# EAGLE design garden_control (EAGLE 8.3.2)
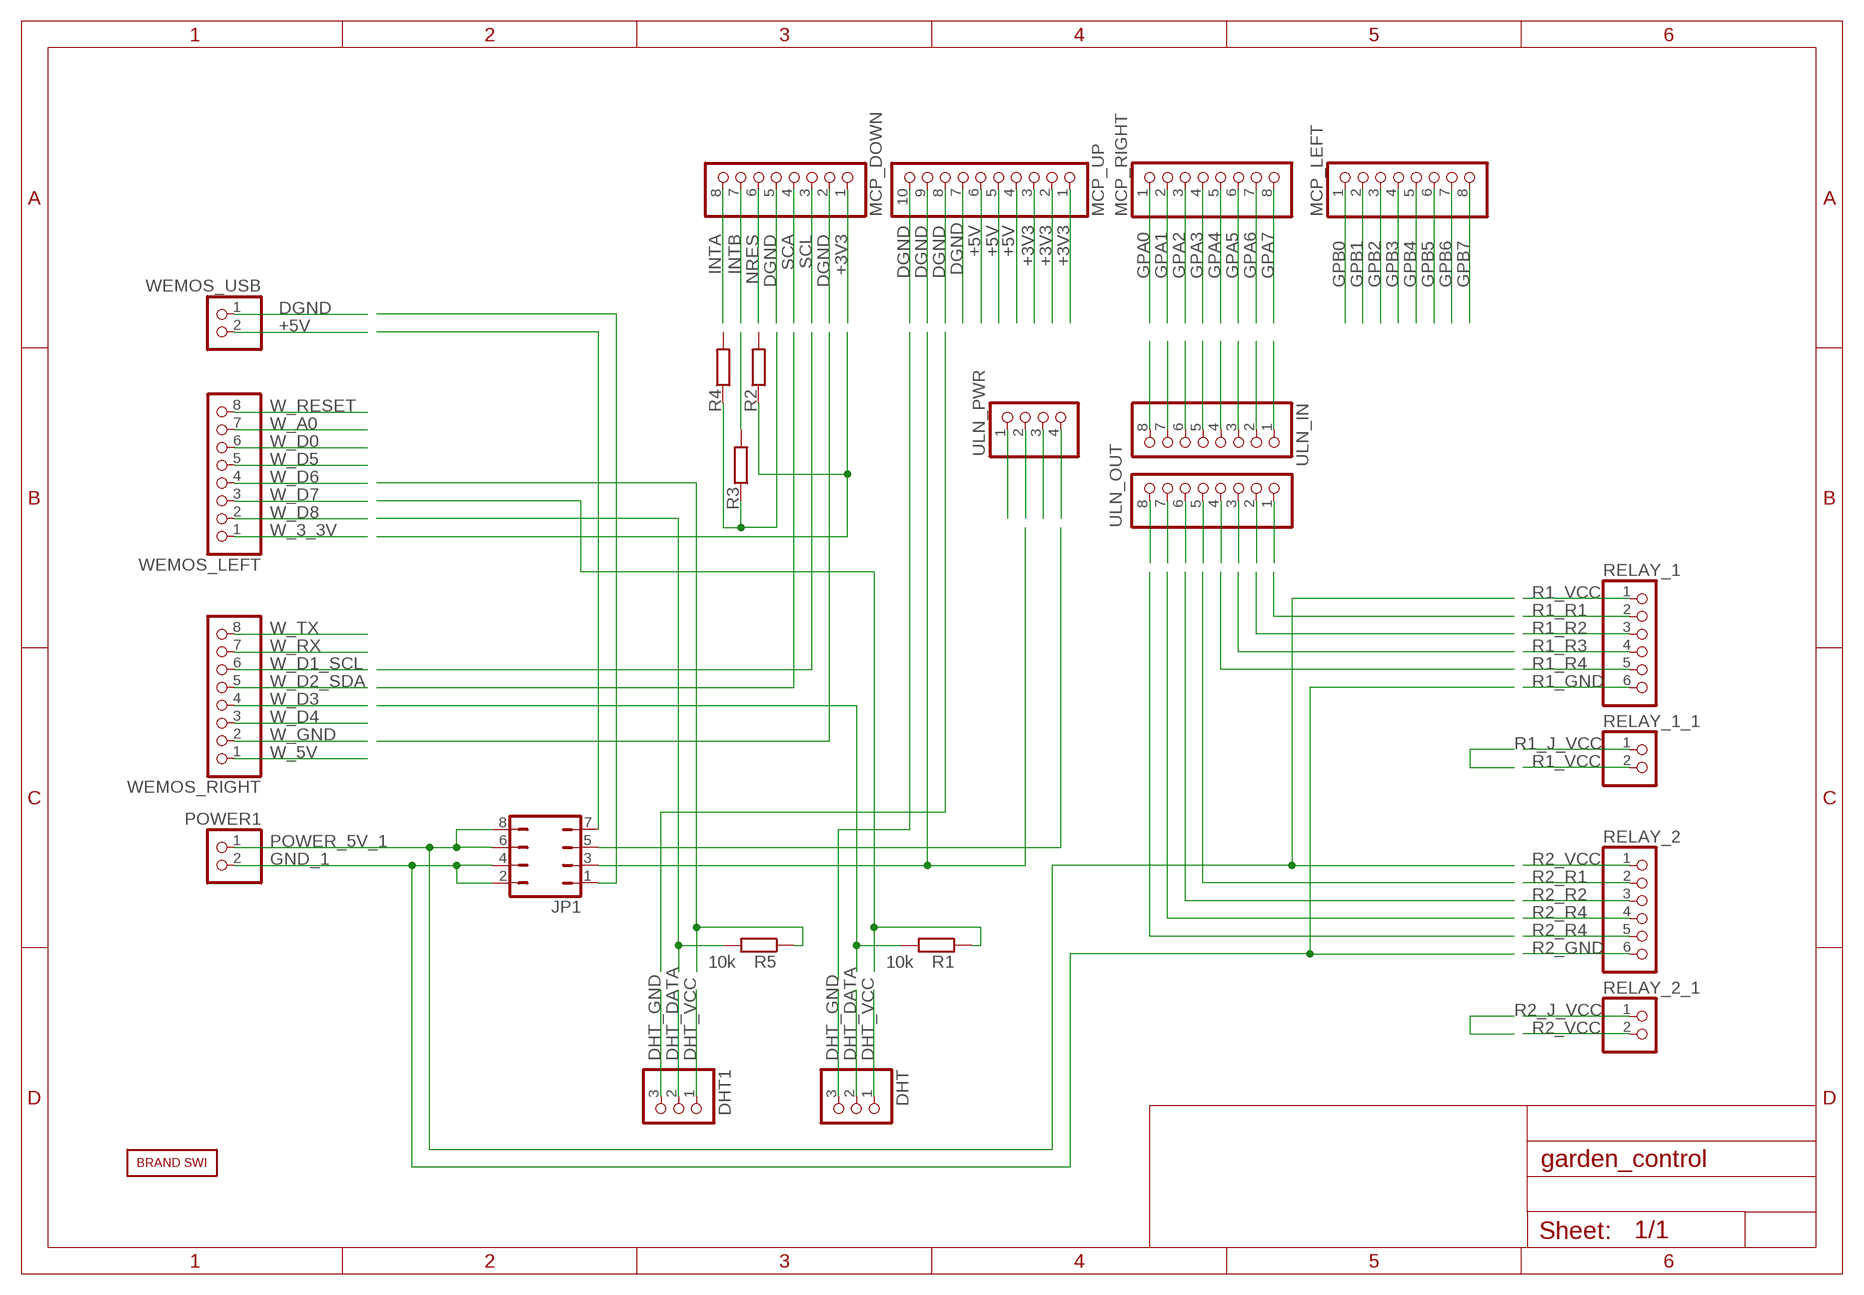
[diagram p0: schematic, sheet 1]

## Parts
DHT  PINHD-1X3  [1X03]
DHT1  PINHD-1X3  [1X03]
JP1  JP4Q  [JP4Q]
MCP_DOWN  PINHD-1X8  [1X08]
MCP_LEFT  PINHD-1X8  [1X08]
MCP_RIGHT  PINHD-1X8  [1X08]
MCP_UP  PINHD-1X10  [1X10]
POWER1  PINHD-1X2  [1X02]
R1  10k  R-EU_0207/10  [0207/10]
R2  R-EU_0204/7  [0204/7]
R3  R-EU_0204/7  [0204/7]
R4  R-EU_0204/7  [0204/7]
R5  10k  R-EU_0207/10  [0207/10]
RELAY_1  PINHD-1X6  [1X06]
RELAY_1_1  PINHD-1X2  [1X02]
RELAY_2  PINHD-1X6  [1X06]
RELAY_2_1  PINHD-1X2  [1X02]
U$2  BRAND_SWI5X7  [BRAND_SWI_5X7]
ULN_IN  PINHD-1X8  [1X08]
ULN_OUT  PINHD-1X8  [1X08]
ULN_PWR  PINHD-1X4  [1X04]
WEMOS_LEFT  PINHD-1X8  [1X08]
WEMOS_RIGHT  PINHD-1X8  [1X08]
WEMOS_USB  PINHD-1X2  [1X02]

## Nets
+3V3: MCP_DOWN.1 MCP_UP.1 MCP_UP.2 MCP_UP.3
+5V: MCP_UP.5 MCP_UP.6 WEMOS_USB.2
DGND: MCP_DOWN.2 MCP_DOWN.5 MCP_UP.8 MCP_UP.9 MCP_UP.10 WEMOS_USB.1
DHT_DATA: DHT1.2 DHT.2
DHT_GND: DHT1.3 DHT.3
DHT_VCC: DHT1.1 DHT.1
GND_1: JP1.2 JP1.4 POWER1.2
GPA0: MCP_RIGHT.1
GPA1: MCP_RIGHT.2
GPA2: MCP_RIGHT.3
GPA3: MCP_RIGHT.4
GPA4: MCP_RIGHT.5
GPA5: MCP_RIGHT.6
GPA6: MCP_RIGHT.7
GPA7: MCP_RIGHT.8
GPB0: MCP_LEFT.1
GPB1: MCP_LEFT.2
GPB2: MCP_LEFT.3
GPB3: MCP_LEFT.4
GPB4: MCP_LEFT.5
GPB5: MCP_LEFT.6
GPB6: MCP_LEFT.7
GPB7: MCP_LEFT.8
INTA: MCP_DOWN.8
INTB: MCP_DOWN.7
N$1: R2.1
N$4: R1.2
N$5: R1.1
N$8: JP1.7
N$9: JP1.3
N$11: JP1.5
N$12: JP1.1
N$13: ULN_OUT.1
N$14: ULN_OUT.2
N$15: ULN_OUT.3
N$16: ULN_OUT.4
N$17: ULN_OUT.5
N$18: ULN_OUT.6
N$19: ULN_OUT.7
N$20: ULN_OUT.8
N$21: R5.2
N$23: ULN_IN.1
N$24: ULN_IN.2
N$25: ULN_IN.3
N$26: ULN_IN.4
N$27: ULN_IN.5
N$28: ULN_IN.6
N$29: ULN_IN.7
N$30: ULN_IN.8
N$31: R5.1
N$32: R3.1 R4.1
N$33: R3.2
N$49: ULN_PWR.1
N$50: ULN_PWR.2
N$51: ULN_PWR.3
N$52: ULN_PWR.4
NRES: MCP_DOWN.6
POWER_5V_1: JP1.6 JP1.8 POWER1.1
R1_GND: RELAY_1.6
R1_J_VCC: RELAY_1_1.1
R1_R1: RELAY_1.2
R1_R2: RELAY_1.3
R1_R3: RELAY_1.4
R1_R4: RELAY_1.5
R1_VCC: RELAY_1.1 RELAY_1_1.2
R2_GND: RELAY_2.6
R2_J_VCC: RELAY_2_1.1
R2_R1: RELAY_2.2
R2_R2: RELAY_2.3
R2_R4: RELAY_2.4 RELAY_2.5
R2_VCC: RELAY_2.1 RELAY_2_1.2
SCA: MCP_DOWN.4
SCL: MCP_DOWN.3
W_3_3V: WEMOS_LEFT.1
W_5V: WEMOS_RIGHT.1
W_A0: WEMOS_LEFT.7
W_D0: WEMOS_LEFT.6
W_D1_SCL: WEMOS_RIGHT.6
W_D2_SDA: WEMOS_RIGHT.5
W_D3: WEMOS_RIGHT.4
W_D4: WEMOS_RIGHT.3
W_D5: WEMOS_LEFT.5
W_D6: WEMOS_LEFT.4
W_D7: WEMOS_LEFT.3
W_D8: WEMOS_LEFT.2
W_GND: WEMOS_RIGHT.2
W_RESET: WEMOS_LEFT.8
W_RX: WEMOS_RIGHT.7
W_TX: WEMOS_RIGHT.8
Unconnected: MCP_UP.4 MCP_UP.7 R2.2 R4.2

## Library data of the parts
DHT DHT1 = pinhead:PINHD-1X3: PIN HEADER
JP1 = jumper:JP4Q: JUMPER
MCP_DOWN MCP_LEFT MCP_RIGHT ULN_IN ULN_OUT WEMOS_LEFT WEMOS_RIGHT = pinhead:PINHD-1X8: PIN HEADER
MCP_UP = pinhead:PINHD-1X10: PIN HEADER
POWER1 RELAY_1_1 RELAY_2_1 WEMOS_USB = pinhead:PINHD-1X2: PIN HEADER
R1-R5 = rcl:R-EU_: RESISTOR, European symbol
RELAY_1 RELAY_2 = pinhead:PINHD-1X6: PIN HEADER
U$2 = BRAND_SWI:BRAND_SWI
ULN_PWR = pinhead:PINHD-1X4: PIN HEADER

## Board
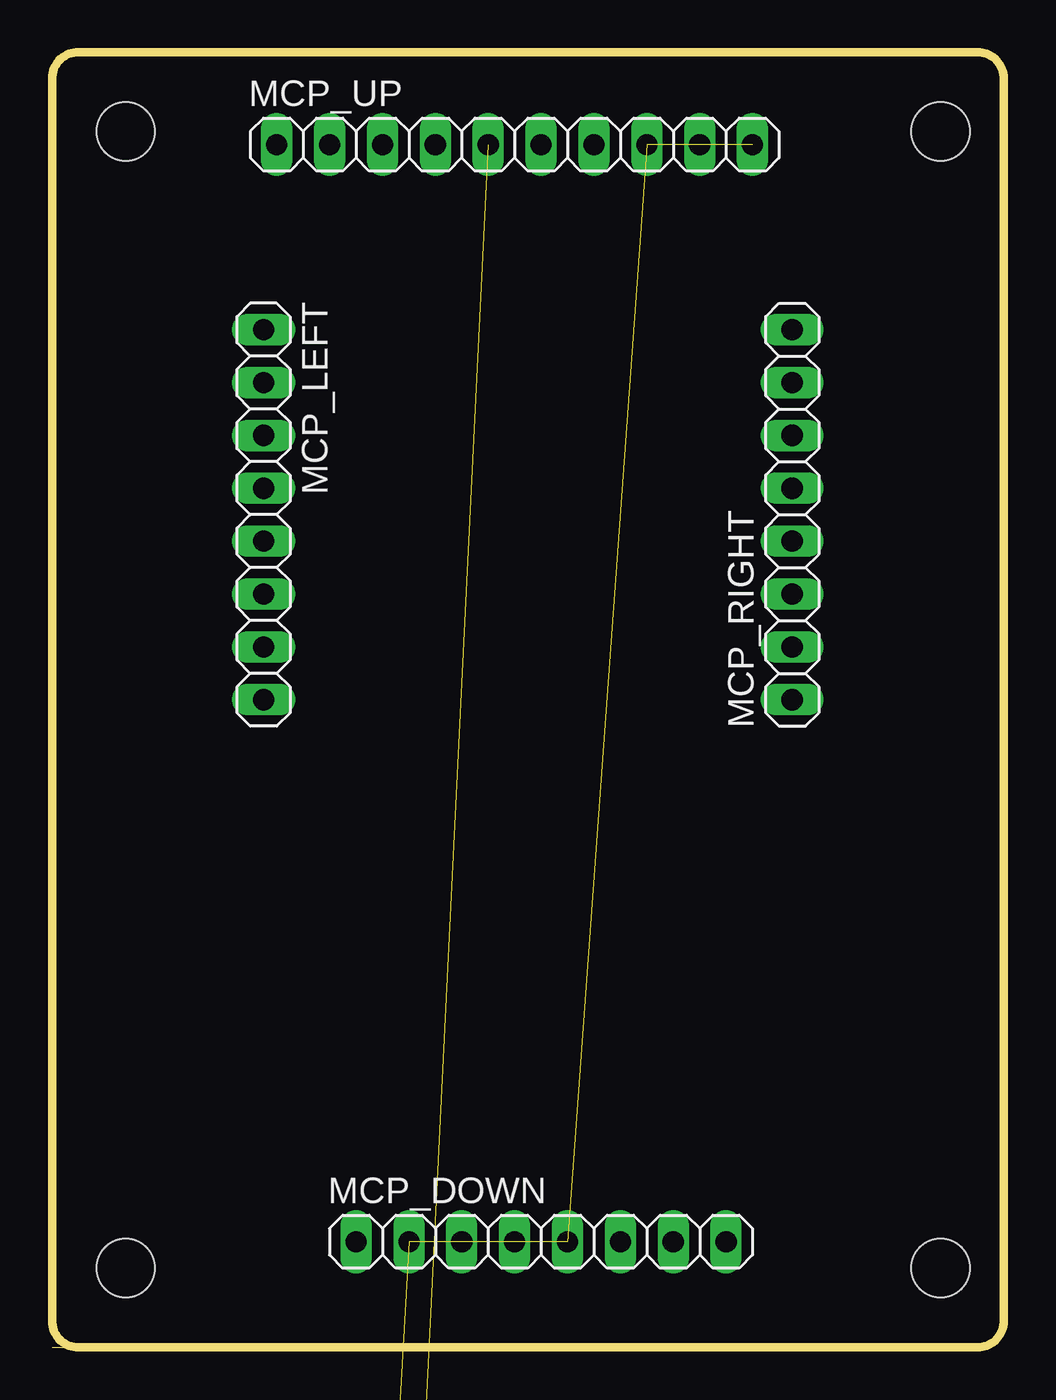
[diagram p1: board, top side]
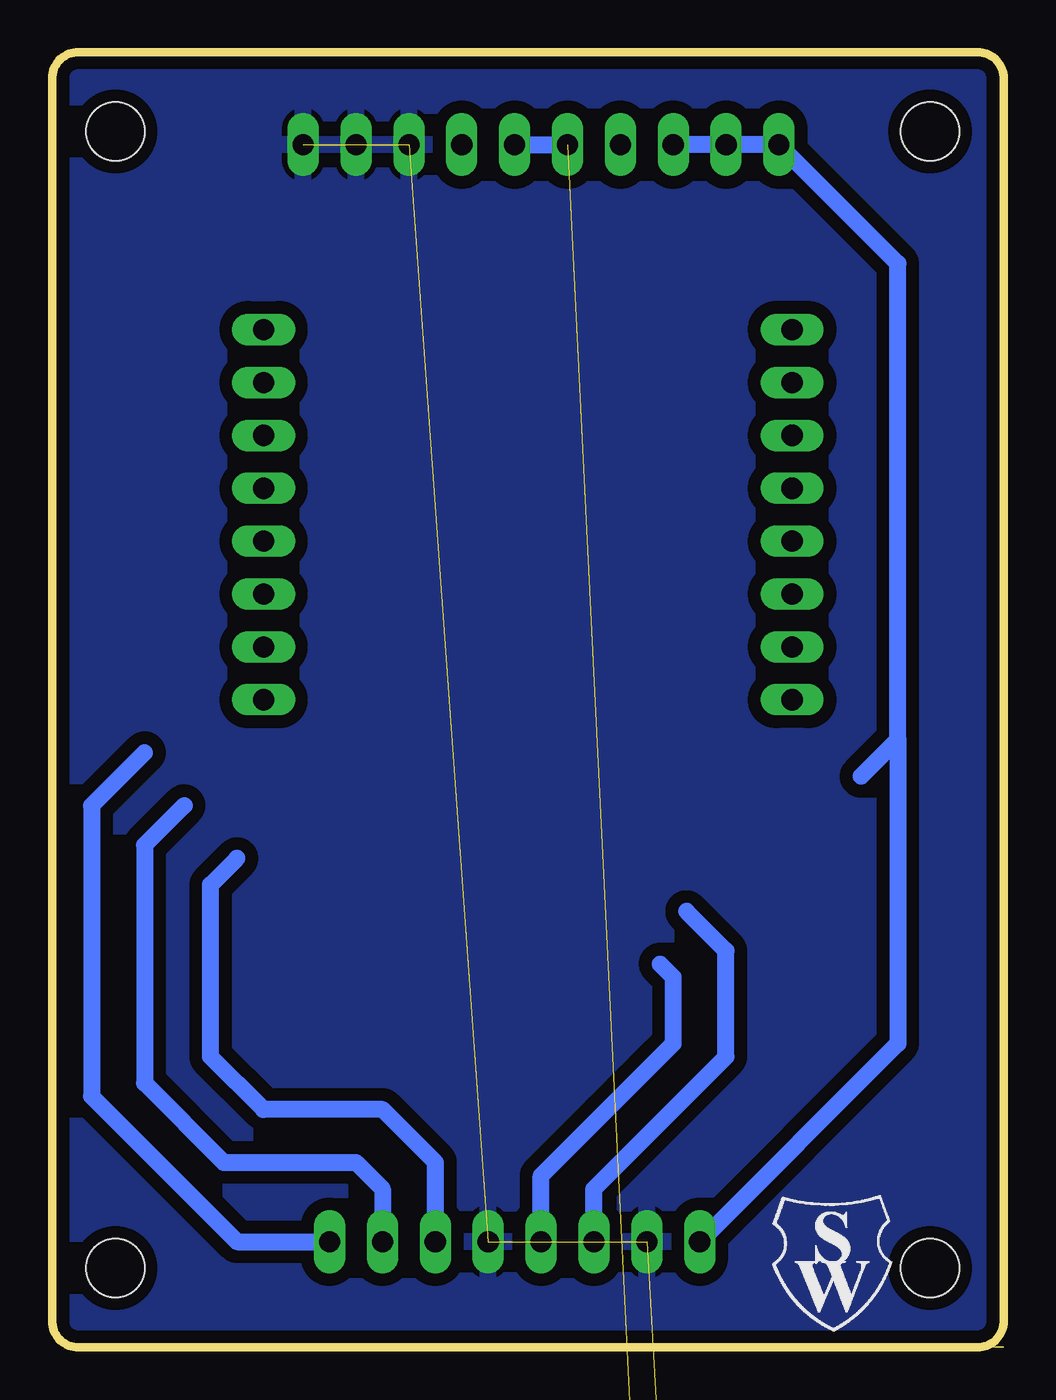
[diagram p2: board, bottom side, seen from below]

Size 45.72 x 62.23 mm. Coordinates in mm from the lower left corner, seen from the top.
Outline: 0,0 1.27,0
Outline: 1.27,0 2.03,0
Outline: 28.45,0 31.42,0
Outline: 1.27,0 44.45,0 arc90 45.72,1.27 45.72,60.96 arc90 44.45,62.23 1.27,62.23 arc90 0,60.96 0,1.27 arc90 1.27,0
Copper layers (1*16): Top 0.035mm / dielectric 1.6mm / Bottom 0.035mm
Design rules "Elecrow_2-layer_PCB_eagle_rule *": minimum track width 12mil, minimum drill 12mil, track to track 6mil, track to pad 6mil, pad to pad 6mil, via to via 8mil, smd to smd 0mil, copper to edge 20mil, drill to drill 10mil, minimum pad ring 6mil, minimum via ring 6mil, stop-mask expansion 0mil, vias tented up to drill 100mil, thermal gap 10mil
Holes 2.8 mm at 3.54,58.42 42.68,58.42 42.68,3.81 3.54,3.81

### Footprints (pad centres in the part's own frame; a part is rotated, then mirrored left to right if it is on the bottom)
1X03 = drill 1.016 long: 1 -2.54,0; 2 0,0; 3 2.54,0
JP4Q = drill 0.914 octagon: 1 -3.81,-1.27; 2 -3.81,1.27; 3 -1.27,-1.27; 4 -1.27,1.27; 5 1.27,-1.27; 6 1.27,1.27; 7 3.81,-1.27; 8 3.81,1.27
1X08 = drill 1.016 long: 1 -8.89,0; 2 -6.35,0; 3 -3.81,0; 4 -1.27,0; 5 1.27,0; 6 3.81,0; 7 6.35,0; 8 8.89,0
1X10 = drill 1.016 long: 1 -11.43,0; 2 -8.89,0; 3 -6.35,0; 4 -3.81,0; 5 -1.27,0; 6 1.27,0; 7 3.81,0; 8 6.35,0; 9 8.89,0; 10 11.43,0
1X02 = drill 1.016 long: 1 -1.27,0; 2 1.27,0
0207/10 = drill 0.813 octagon: 1 -5.08,0; 2 5.08,0
0204/7 = drill 0.813 octagon: 1 -3.81,0; 2 3.81,0
1X06 = drill 1.016 long: 1 -6.35,0; 2 -3.81,0; 3 -1.27,0; 4 1.27,0; 5 3.81,0; 6 6.35,0
1X04 = drill 1.016 long: 1 -3.81,0; 2 -1.27,0; 3 1.27,0; 4 3.81,0

### Placement (x,y rotation side)
DHT  10.16,-116.84 0 top  (outside the outline)
DHT1  10.16,-290.83 0 top  (outside the outline)
JP1  10.79,-145.41 0 top  (outside the outline)
MCP_DOWN  23.5,5.08 0 top
MCP_LEFT  10.16,40.01 270 top
MCP_RIGHT  35.56,40.01 90 top
MCP_UP  22.23,57.78 0 top
POWER1  8.89,-40.64 0 top  (outside the outline)
R1  10.79,-130.81 0 top  (outside the outline)
R2  9.53,-251.46 0 top  (outside the outline)
R3  9.53,-264.16 0 top  (outside the outline)
R4  9.53,-276.86 0 top  (outside the outline)
R5  10.79,-304.8 0 top  (outside the outline)
RELAY_1  13.97,-55.88 0 top  (outside the outline)
RELAY_1_1  8.89,-71.12 0 top  (outside the outline)
RELAY_2  13.97,-86.36 0 top  (outside the outline)
RELAY_2_1  8.89,-101.6 0 top  (outside the outline)
U$2  11.3,0.64 0 bottom
ULN_IN  16.51,-222.25 0 top  (outside the outline)
ULN_OUT  16.51,-237.49 0 top  (outside the outline)
ULN_PWR  11.43,-207.01 0 top  (outside the outline)
WEMOS_LEFT  16.51,-10.16 0 top  (outside the outline)
WEMOS_RIGHT  16.51,-25.4 0 top  (outside the outline)
WEMOS_USB  8.89,-161.29 0 top  (outside the outline)

### Tracks (layer width: path | path; a pad name or v marks a point on that pad's centre or on a via)
+3V3
  Bottom 0.813: MCP_DOWN.1 5.08,14.61 5.08,29.21 | 5.08,29.21 5.08,52.07 MCP_UP.1 MCP_UP.2 MCP_UP.3 | 6.86,27.43 5.08,29.21
+5V  (1 unrouted)
  Bottom 0.813: MCP_UP.6 MCP_UP.5
DGND  (5 unrouted)
  pour Bottom (isolate 0.61): 0,59.69 arc-90 2.54,62.23 3.81,62.23 43.18,62.23 arc-90 45.72,59.69 45.72,2.54 arc-90 43.18,0 41.91,0 1.27,0 arc-90 0,1.27 0,2.54
DHT_DATA  (1 unrouted)
DHT_GND  (1 unrouted)
DHT_VCC  (1 unrouted)
GND_1  (2 unrouted)
GPB7
  Bottom 0.813: MCP_LEFT.8 9.53,31.11 MCP_LEFT.8
INTA
  Bottom 0.813: 41.27,28.57 43.81,26.04 43.81,12.06 36.83,5.08 MCP_DOWN.8
INTB
  Bottom 0.813: 39.37,26.04 41.27,24.13 41.27,12.7 37.47,8.89 31.11,8.89 29.84,7.62 MCP_DOWN.7
N$32  (1 unrouted)
NRES
  Bottom 0.813: MCP_DOWN.6 27.3,8.89 29.84,11.43 35.56,11.43 38.1,13.97 38.1,22.23 36.83,23.5
POWER_5V_1  (2 unrouted)
R1_VCC  (1 unrouted)
R2_R4  (1 unrouted)
R2_VCC  (1 unrouted)
SCA
  Bottom 0.813: 16.51,18.41 15.88,17.78 15.88,14.61 22.23,8.26 MCP_DOWN.4
SCL
  Bottom 0.813: 15.24,20.95 13.97,19.68 13.34,19.05 13.34,13.97 19.68,7.62 MCP_DOWN.3

### Text on the board
bRestrict: PN39022R1B1 | WSHIELD_MCP_BASIC